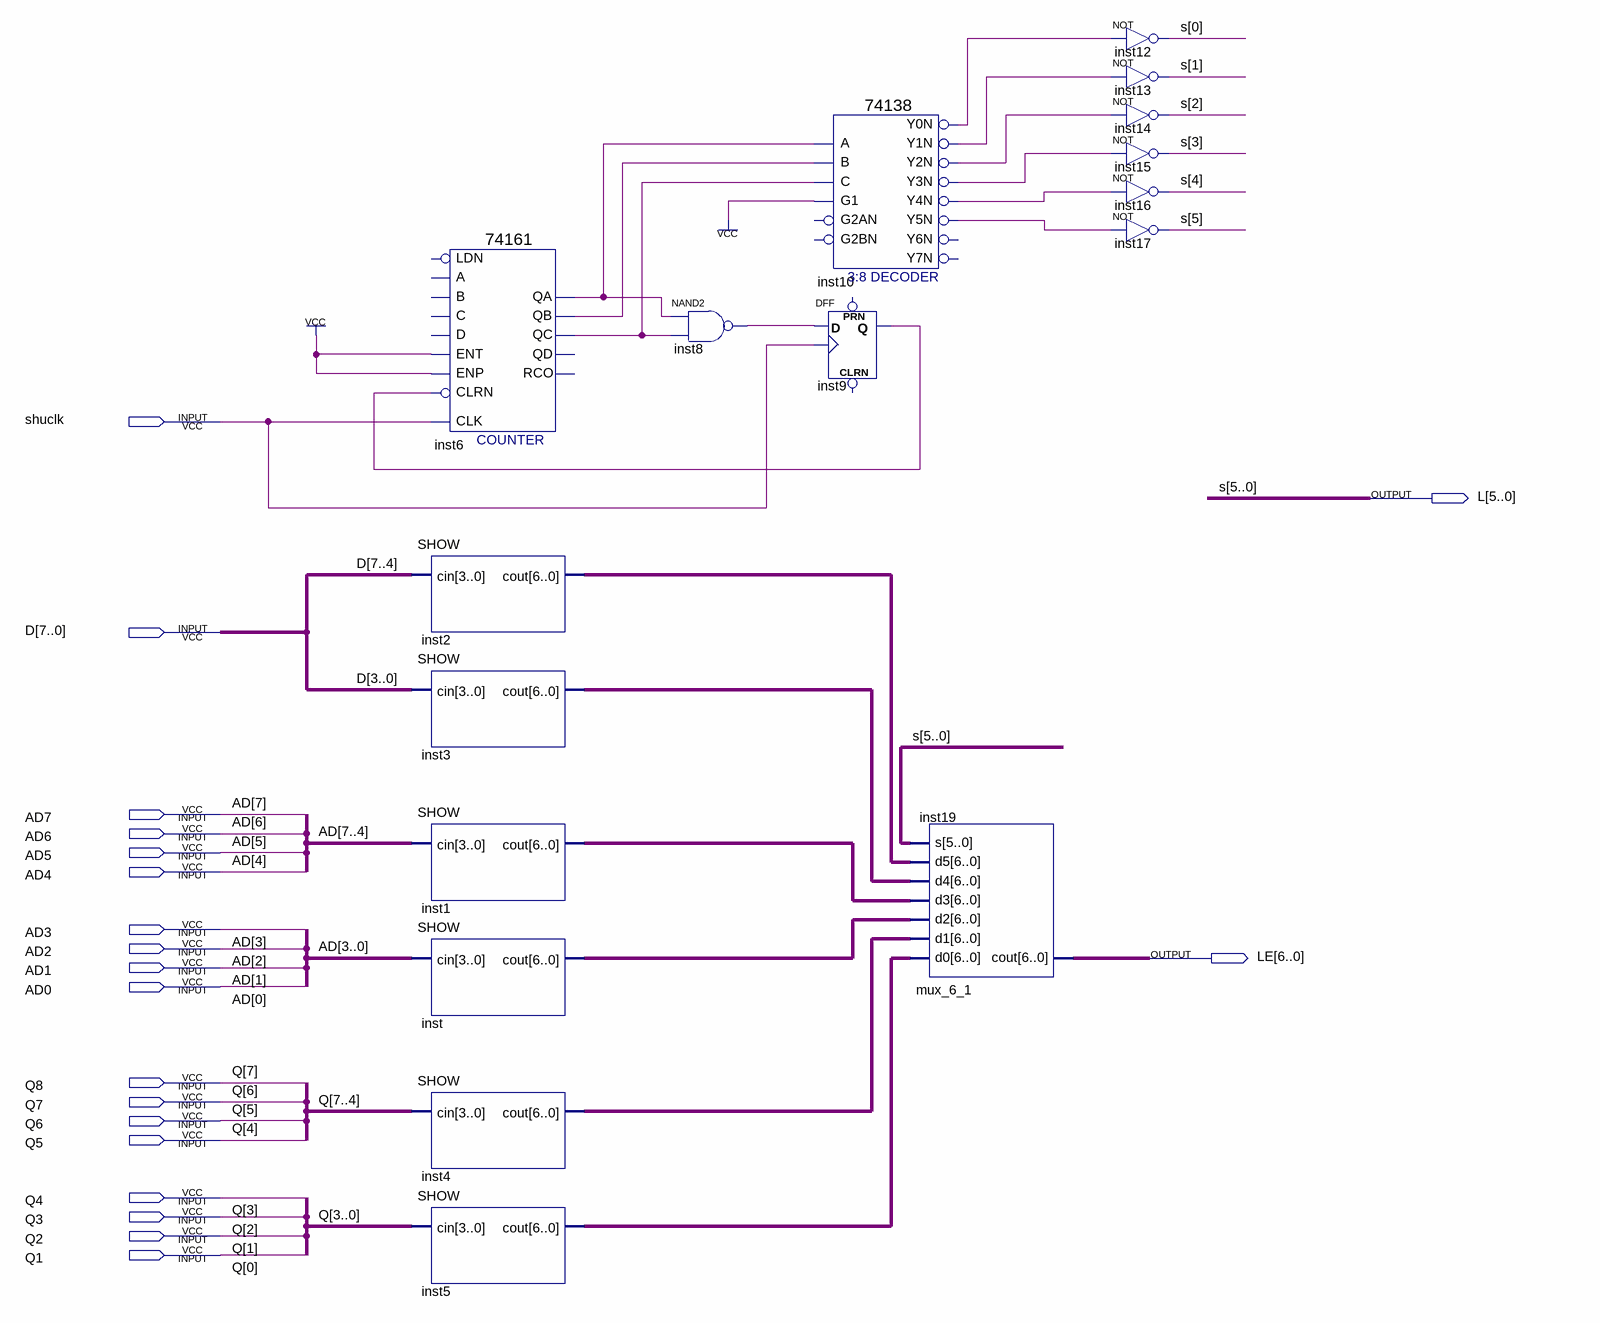
[diagram p0: schematic sheet]
// Quartus schematic XIANSHI.bdf as structural Verilog: 17 symbols, 20 pins
module XIANSHI (
  input  shuclk,
  input  [7:0] D,
  input  AD7,
  input  AD6,
  input  AD5,
  input  AD4,
  input  AD3,
  input  AD2,
  input  AD1,
  input  AD0,
  input  Q8,
  input  Q7,
  input  Q6,
  input  Q5,
  input  Q4,
  input  Q3,
  input  Q2,
  input  Q1,
  output [5:0] L,
  output [6:0] LE
);

  wire inst6_qa, inst6_qb, inst6_qc, inst8_out, inst9_q, inst10_y0n, inst10_y1n, inst10_y2n, inst10_y3n,
       inst10_y4n, inst10_y5n;
  wire [6:0] inst1_cout, inst2_cout, inst3_cout, inst4_cout, inst5_cout, inst_cout;

  \74161  inst6 (
    .CLRN(inst9_q), .CLK(shuclk), .ENP(1'b1), .ENT(1'b1), .QC(inst6_qc), .QB(inst6_qb), .QA(inst6_qa));  // open: LDN, A, D, B, C, QD, RCO
  SHOW inst2 (.cin(D[7:4]), .cout(inst2_cout));
  SHOW inst3 (.cin(D[3:0]), .cout(inst3_cout));
  SHOW inst1 (.cin({AD7, AD6, AD5, AD4}), .cout(inst1_cout));
  SHOW inst (.cin({AD3, AD2, AD1, AD0}), .cout(inst_cout));
  SHOW inst4 (.cin({Q8, Q7, Q6, Q5}), .cout(inst4_cout));
  SHOW inst5 (.cin({Q4, Q3, Q2, Q1}), .cout(inst5_cout));
  nand inst8 (inst8_out, inst6_qa, inst6_qc);
  \74138  inst10 (
    .A(inst6_qa), .B(inst6_qb), .G1(1'b1), .C(inst6_qc), .Y0N(inst10_y0n), .Y1N(inst10_y1n),
    .Y2N(inst10_y2n), .Y3N(inst10_y3n), .Y4N(inst10_y4n), .Y5N(inst10_y5n));  // open: G2AN, G2BN, Y6N, Y7N
  DFF inst9 (.CLK(shuclk), .D(inst8_out), .Q(inst9_q));  // open: CLRN, PRN
  mux_6_1 inst19 (
    .d0(inst5_cout), .d1(inst4_cout), .d2(inst_cout), .d3(inst1_cout), .d4(inst3_cout), .d5(inst2_cout),
    .s(L), .cout(LE));
  not inst12 (L[0], inst10_y0n);
  not inst13 (L[1], inst10_y1n);
  not inst14 (L[2], inst10_y2n);
  not inst15 (L[3], inst10_y3n);
  not inst16 (L[4], inst10_y4n);
  not inst17 (L[5], inst10_y5n);

  // Other names for the same wires on the sheet: Q[7:0] = {Q8, Q7, Q6, Q5, Q4, Q3, Q2, Q1}; s[5:0] = L
endmodule
